# EAGLE design bcd board (EAGLE 6.2)
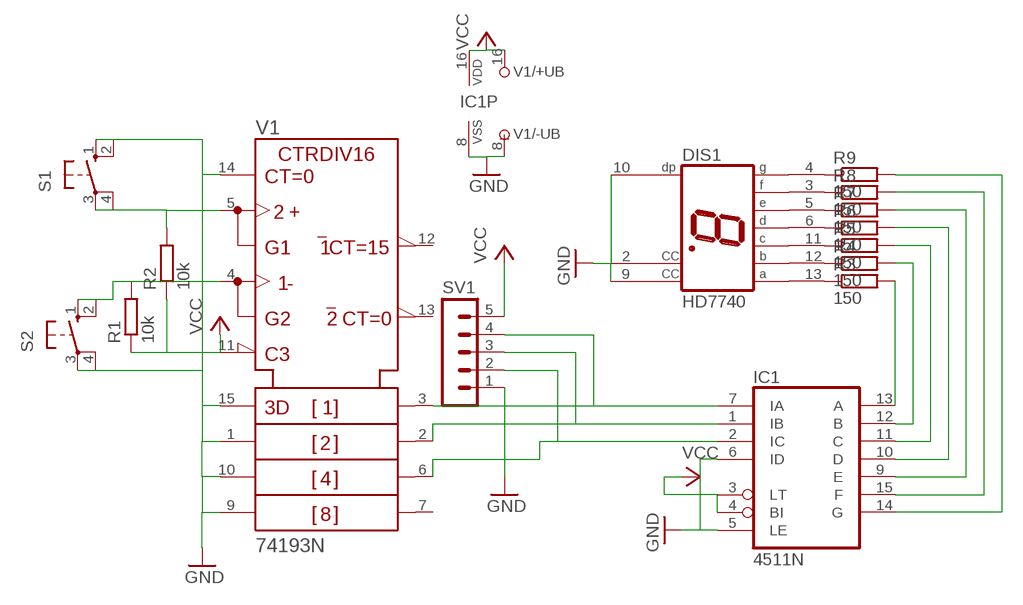
[diagram p0: schematic, sheet 1]

## Parts
DIS1  HD7740  [HD7730]
IC1  4511N  [DIL16]
R1  10k  R-EU_0204/7  [0204/7]
R2  10k  R-EU_0204/7  [0204/7]
R3  150  R-EU_0204/7  [0204/7]
R4  150  R-EU_0204/7  [0204/7]
R5  150  R-EU_0204/7  [0204/7]
R6  150  R-EU_0204/7  [0204/7]
R7  150  R-EU_0204/7  [0204/7]
R8  150  R-EU_0204/7  [0204/7]
R9  150  R-EU_0204/7  [0204/7]
S1  10-XX  [B3F-10XX]
S2  10-XX  [B3F-10XX]
SV1  MA05-1  [MA05-1]
V1  74193N  [DIL16]

## Nets
GND: DIS1.2(CC) DIS1.9(CC) DIS1.10(DP) IC1.5(LE) IC1.6(ID) IC1.8(VSS) S1.1(S) S1.2(S1) S2.3(P) S2.4(P1) SV1.1 V1.1(B) V1.8(-UB) V1.9(D) V1.10(C) V1.14(CLR) V1.15(A)
N$1: DIS1.13(A) R3.1
N$2: DIS1.12(B) R4.1
N$3: DIS1.11(C) R5.1
N$4: DIS1.6(D) R6.1
N$5: DIS1.5(E) R7.1
N$6: DIS1.3(F) R8.1
N$7: DIS1.4(G) R9.1
N$8: IC1.13(A) R3.2
N$9: IC1.12(B) R4.2
N$10: IC1.11(C) R5.2
N$11: IC1.10(D) R6.2
N$12: IC1.9(E) R7.2
N$13: IC1.15(F) R8.2
N$14: IC1.14(G) R9.2
N$15: R2.2 S1.3(P) S1.4(P1) V1.5(UP)
N$16: IC1.1(IB) SV1.3 V1.2(QB)
N$18: R1.2 S2.1(S) S2.2(S1) V1.4(DOWN)
N$21: IC1.7(IA) SV1.4 V1.3(QA)
N$23: IC1.2(IC) SV1.2 V1.6(QC)
VCC: IC1.3(LT) IC1.4(BI) IC1.16(VDD) R1.1 R2.1 SV1.5 V1.11(!LOAD) V1.16(+UB)
Unconnected: V1.7(QD) V1.12(!CO) V1.13(!BO)

## Library data of the parts
DIS1 = display-hp:HD7740: LED DISPLAY 1-character 7 segment, decimal point right; OC_FARNELL: unknown; OC_NEWARK: unknown
IC1 = 45xx:4511: BCD to 7-segment LATCH/DECODER/DRIVER
R1-R9 = resistor:R-EU_: RESISTOR, European symbol
S1 S2 = switch-omron:10-XX: OMRON SWITCH; MPN: B3F-1000; OC_FARNELL: 176432; OC_NEWARK: 36M3542
SV1 = con-lstb:MA05-1: PIN HEADER; OC_FARNELL: unknown; OC_NEWARK: unknown
V1 = 74ttl-din:74*193: Synchronus 4-bit up down COUNTER

## Board
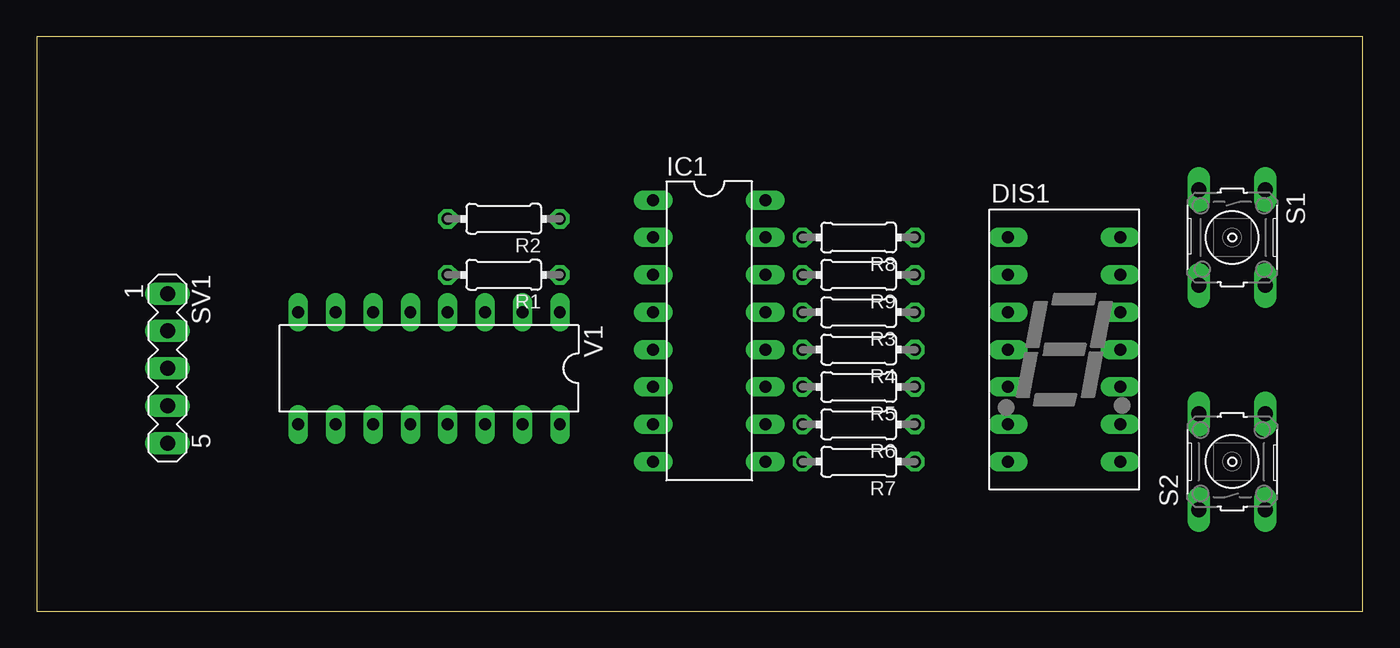
[diagram p1: board, top side]
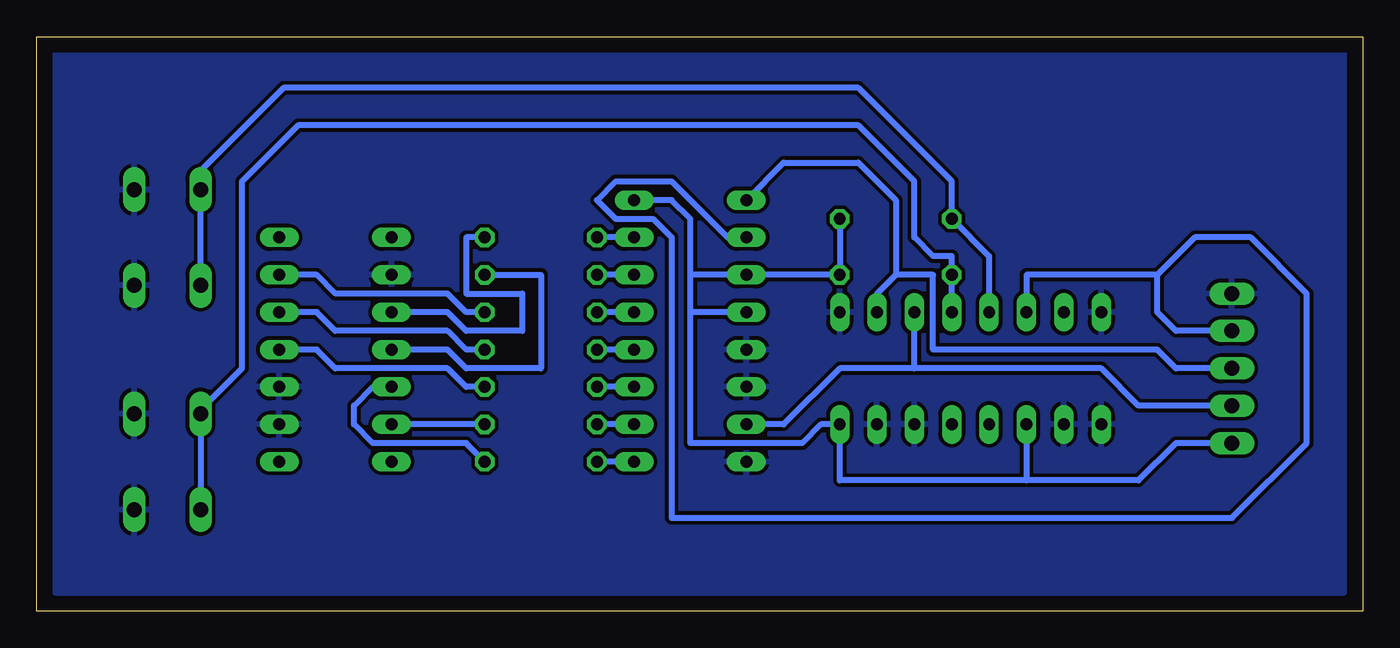
[diagram p2: board, bottom side, seen from below]

Size 90.15 x 39.04 mm. Coordinates in mm from the lower left corner, seen from the top.
Outline: 0,0 90.15,0 90.15,39.04 0,39.04 0,0
Copper layers (1*16): Top 0.035mm / dielectric 1.5mm / Bottom 0.035mm
Design rules: minimum track width 10mil, minimum drill 24mil, track to track 8mil, track to pad 8mil, pad to pad 8mil, via to via 8mil, smd to smd 8mil, copper to edge 40mil, drill to drill 8mil, minimum pad ring 10mil, minimum via ring 8mil, stop-mask expansion 4mil, vias tented up to drill 0mil, thermal gap 10mil

### Footprints (pad centres in the part's own frame; a part is rotated, then mirrored left to right if it is on the bottom)
HD7730 = drill 0.813 long: 1 -3.81,7.62; 2 -3.81,5.08; 3 -3.81,2.54; 4 -3.81,0; 5 -3.81,-2.54; 6 -3.81,-5.08; 7 -3.81,-7.62; 8 3.81,-7.62; 9 3.81,-5.08; 10 3.81,-2.54; 11 3.81,0; 12 3.81,2.54; 13 3.81,5.08; 14 3.81,7.62
DIL16 = drill 0.813 long: 1 -8.89,-3.81; 2 -6.35,-3.81; 3 -3.81,-3.81; 4 -1.27,-3.81; 5 1.27,-3.81; 6 3.81,-3.81; 7 6.35,-3.81; 8 8.89,-3.81; 9 8.89,3.81; 10 6.35,3.81; 11 3.81,3.81; 12 1.27,3.81; 13 -1.27,3.81; 14 -3.81,3.81; 15 -6.35,3.81; 16 -8.89,3.81
0204/7 = drill 0.813 octagon: 1 -3.81,0; 2 3.81,0
B3F-10XX = drill 1.016 long: 1 -3.251,2.261; 2 3.251,2.261; 3 -3.251,-2.261; 4 3.251,-2.261
MA05-1 = drill 1.016 long: 1 -5.08,0; 2 -2.54,0; 3 0,0; 4 2.54,0; 5 5.08,0

### Placement (x,y rotation side)
DIS1  69.85,17.78 0 top
IC1  45.72,19.05 270 top
R1  31.75,22.86 180 top
R2  31.75,26.67 180 top
R3  55.88,20.32 180 top
R4  55.88,17.78 180 top
R5  55.88,15.24 180 top
R6  55.88,12.7 180 top
R7  55.88,10.16 180 top
R8  55.88,25.4 180 top
R9  55.88,22.86 180 top
S1  81.28,25.4 270 top
S2  81.28,10.16 90 top
SV1  8.89,16.51 270 top
V1  26.67,16.51 180 top

### Tracks (layer width: path | path; a pad name or v marks a point on that pad's centre or on a via)
GND
  pour Bottom (isolate 0.254): 1.27,38.1 88.9,38.1 88.9,1.27 1.27,1.27
N$1
  Bottom 0.406: R3.1 60.96,20.32 62.23,21.59 69.85,21.59 71.12,22.86 DIS1.13
N$2
  Bottom 0.406: R4.1 60.96,17.78 62.23,19.05 69.85,19.05 71.12,20.32 DIS1.12
N$3
  Bottom 0.406: R5.1 60.96,15.24 62.23,16.51 69.85,16.51 71.12,17.78 DIS1.11
N$4
  Bottom 0.406: R6.1 DIS1.6
N$5
  Bottom 0.406: R7.1 60.96,11.43 67.31,11.43 68.58,12.7 68.58,13.97 67.31,15.24 DIS1.5
N$6
  Bottom 0.406: R8.1 60.96,25.4 60.96,21.59 57.15,21.59 57.15,19.05 60.96,19.05 62.23,20.32 DIS1.3
N$7
  Bottom 0.406: R9.1 55.88,22.86 55.88,16.51 60.96,16.51 62.23,17.78 DIS1.4
N$8
  Bottom 0.406: IC1.13 R3.2
N$9
  Bottom 0.406: IC1.12 R4.2
N$10
  Bottom 0.406: IC1.11 R5.2
N$11
  Bottom 0.406: IC1.10 R6.2
N$12
  Bottom 0.406: IC1.9 R7.2
N$13
  Bottom 0.406: IC1.15 R8.2
N$14
  Bottom 0.406: IC1.14 R9.2
N$15
  Bottom 0.406: V1.5 25.4,24.13 R2.2 27.94,29.21 34.29,35.56 73.38,35.56 79.02,29.92 S1.3 S1.4
N$16
  Bottom 0.406: 31.75,22.86 29.21,22.86 29.21,17.78 13.97,17.78 12.7,16.51 SV1.3 | IC1.1 39.37,30.48 34.29,30.48 31.75,27.94 31.75,22.86 | 31.75,22.86 33.02,21.59 V1.2
N$18
  Bottom 0.406: V1.4 R1.2 27.94,24.13 29.21,24.13 30.48,25.4 30.48,29.21 34.29,33.02 72.39,33.02 76.2,29.21 76.2,16.51 79.02,13.69 S2.2 S2.1
N$21
  Bottom 0.406: 30.48,16.51 V1.3 | 30.48,16.51 35.56,16.51 39.37,12.7 IC1.7 | SV1.4 15.24,13.97 17.78,16.51 30.48,16.51
N$23
  Bottom 0.406: 13.97,22.86 22.86,22.86 V1.6 | IC1.2 43.18,25.4 46.99,29.21 50.8,29.21 52.07,27.94 50.8,26.67 48.26,26.67 46.99,25.4 46.99,6.35 8.89,6.35 3.81,11.43 3.81,21.59 7.62,25.4 11.43,25.4 13.97,22.86 | SV1.2 12.7,19.05 13.97,20.32 13.97,22.86
VCC
  Bottom 0.406: 22.86,8.89 15.24,8.89 12.7,11.43 SV1.5 | V1.11 22.86,8.89 | 22.86,8.89 35.56,8.89 V1.16 36.83,12.7 38.1,11.43 45.72,11.43 45.72,20.32 | 45.72,20.32 45.72,22.86 | 45.72,22.86 45.72,26.67 46.99,27.94 IC1.16 | 45.72,22.86 IC1.3 R1.1 R2.1 | IC1.4 45.72,20.32